# EAGLE design matrix-cell (EAGLE 7.2.0)
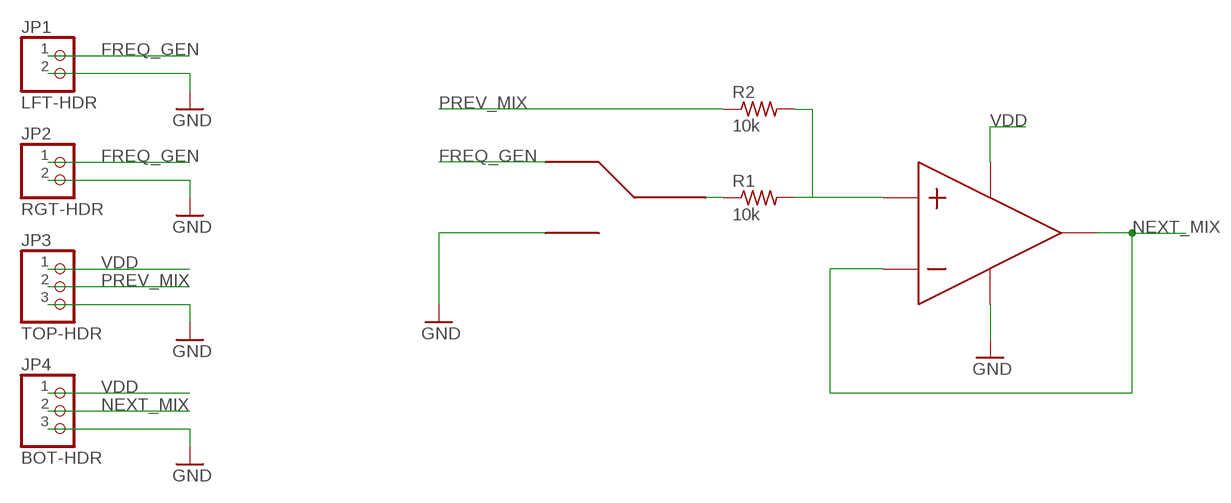
[diagram p0: schematic, sheet 1]

## Parts
JP1  LFT-HDR  PINHD-1X2/90  [1X02/90]
JP2  RGT-HDR  PINHD-1X2/90  [1X02/90]
JP3  TOP-HDR  PINHD-1X3/90  [1X03/90]
JP4  BOT-HDR  PINHD-1X3/90  [1X03/90]
R1  10k  R-US_R1206  [R1206]
R2  10k  R-US_R1206  [R1206]
U$1  RA1-SWITCH  [RA11131100-SWITCH]
U$2  MCP4162-OPAMP  [SO08]

## Nets
FREQ_GEN: JP1.1 JP2.1 U$1.R(NO)
GND: JP1.2 JP2.2 JP3.3 JP4.3 U$1.L(NC) U$2.4(VSS)
N$1: R1.2 R2.2 U$2.3(NON-INV)
N$2: R1.1 U$1.C(COMM)
NEXT_MIX: JP4.2 U$2.2(INV) U$2.6(OUT)
PREV_MIX: JP3.2 R2.1
VDD: JP3.1 JP4.1 U$2.7(VDD)

## Library data of the parts
JP1 JP2 = pinhead:PINHD-1X2: PIN HEADER
JP3 JP4 = pinhead:PINHD-1X3: PIN HEADER
R1 R2 = rcl:R-US_: RESISTOR, American symbol
U$1 = Tone-Matrix:RA1-SWITCH
U$2 = Tone-Matrix:MCP4162-OPAMP

## Board
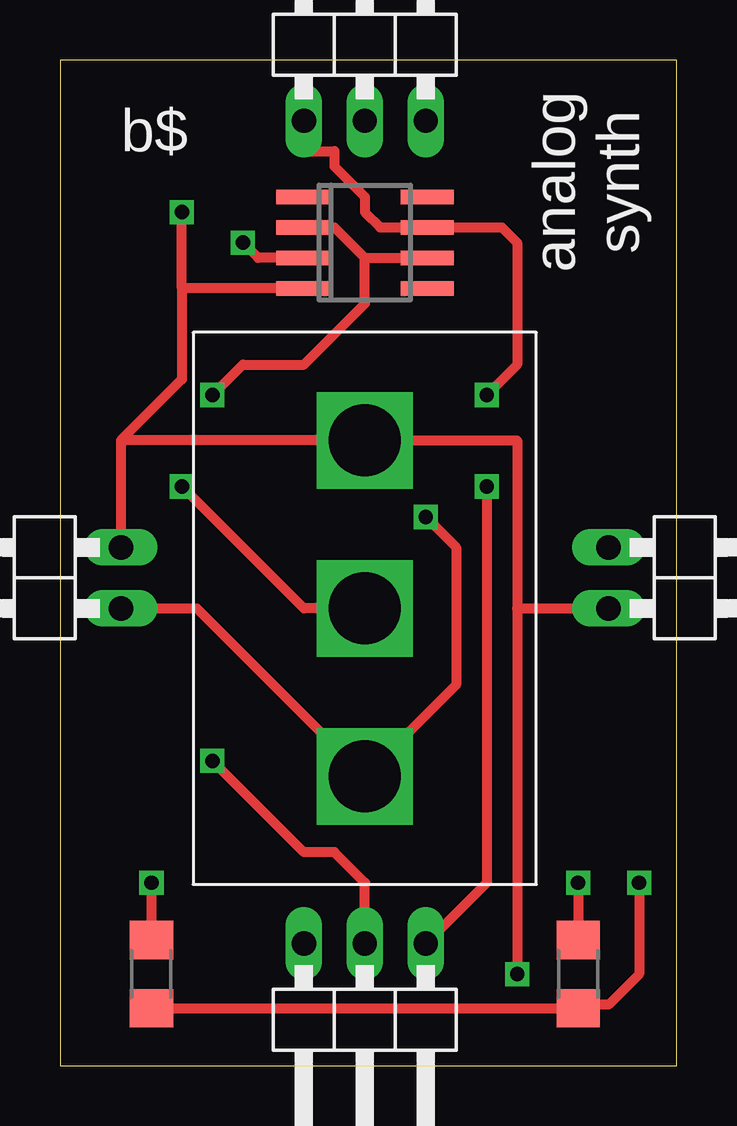
[diagram p1: board, top side]
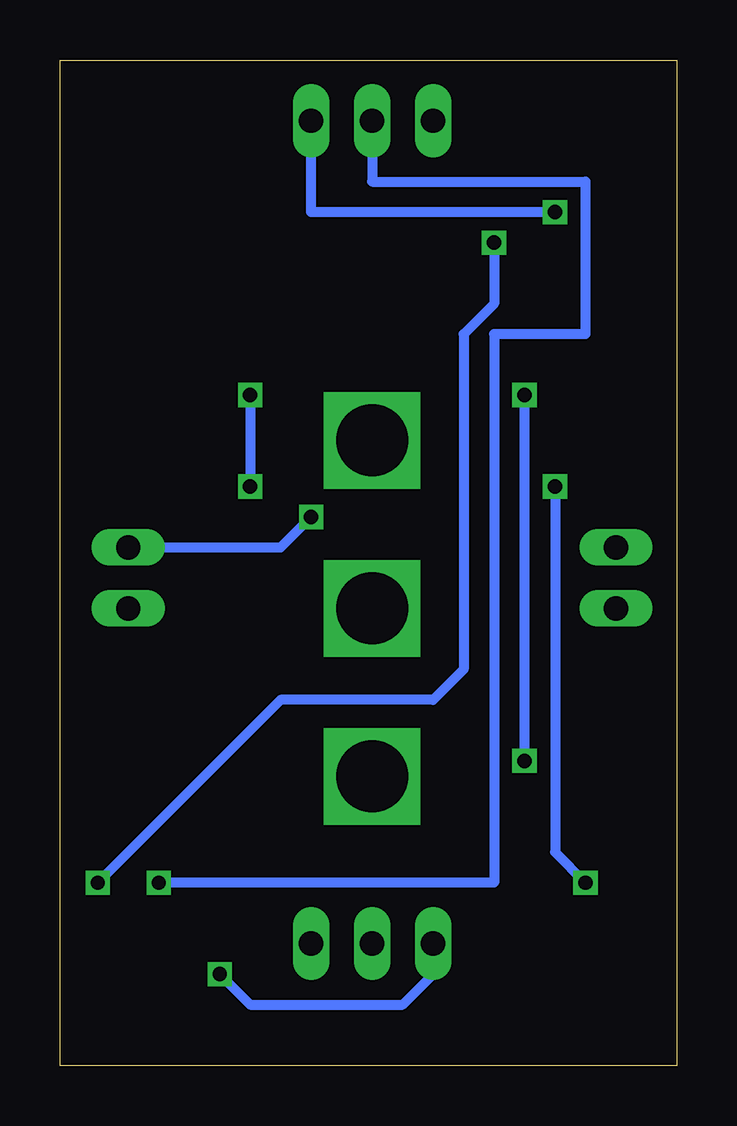
[diagram p2: board, bottom side, seen from below]

Size 25.7 x 41.9 mm. Coordinates in mm from the lower left corner, seen from the top.
Outline: 0,0 25.7,0 25.7,41.9 0,41.9 0,0
Copper layers (1*16): Top 0.035mm / dielectric 1.5mm / Bottom 0.035mm
Design rules "default": minimum track width 10mil, minimum drill 24mil, track to track 8mil, track to pad 8mil, pad to pad 8mil, via to via 8mil, smd to smd 8mil, copper to edge 40mil, drill to drill 8mil, minimum pad ring 10mil, minimum via ring 8mil, stop-mask expansion 4mil, vias tented up to drill 0mil, thermal gap 10mil

### Footprints (pad centres in the part's own frame; a part is rotated, then mirrored left to right if it is on the bottom)
1X02/90 = drill 1.016 long: 1 -1.27,-3.81; 2 1.27,-3.81
1X03/90 = drill 1.016 long: 1 -2.54,-3.81; 2 0,-3.81; 3 2.54,-3.81
R1206 = smd 1.6 x 1.803: 1 -1.422,0; 2 1.422,0
RA11131100-SWITCH = drill 3 square: C 0,0; L -7,0; R 7,0
SO08 = smd 0.6 x 2.2: 1 -1.905,-2.6; 2 -0.635,-2.6; 3 0.635,-2.6; 4 1.905,-2.6; 5 1.905,2.6; 6 0.635,2.6; 7 -0.635,2.6; 8 -1.905,2.6

### Placement (x,y rotation side)
JP1  -1.27,20.32 90 top
JP2  26.67,20.32 270 top
JP3  12.7,43.18 0 top
JP4  12.7,1.27 180 top
R1  3.81,3.81 270 top
R2  21.59,3.81 270 top
U$1  12.7,19.05 270 top
U$2  12.7,34.29 270 top

### Tracks (layer width: path | path; a pad name or v marks a point on that pad's centre or on a via)
FREQ_GEN  (via drill 0.6)
  Top 0.406: v15.24,22.86 16.51,21.59 16.51,15.86 U$1.R 5.7,19.05 JP1.1
  Bottom 0.406: JP2.1 16.51,21.59 v15.24,22.86
GND  (via drill 0.6)
  Top 0.406: 19.05,19.05 19.05,26.05 U$1.L 2.54,26.05 | 19.05,19.05 JP2.2 | 2.54,26.05 JP1.2 | U$2.4 5.08,32.38 | 5.08,32.38 v5.08,35.56 | 5.08,32.38 5.08,28.59 2.54,26.05 | 19.05,19.05 v19.05,3.81
  Bottom 0.406: v5.08,35.56 15.24,35.56 JP3.3 | v19.05,3.81 17.78,2.54 11.43,2.54 10.16,3.81 JP4.3
N$1  (via drill 0.6)
  Top 0.406: R1.2 R2.2 21.74,2.54 22.86,2.54 24.13,3.81 v24.13,7.62 | U$2.3 8.26,33.66 v7.62,34.29
  Bottom 0.406: v7.62,34.29 7.62,31.75 8.89,30.48 8.89,16.51 10.16,15.24 16.51,15.24 v24.13,7.62
N$2  (via drill 0.6)
  Top 0.406: U$1.C 10.16,19.05 v5.08,24.13 | v3.81,7.62 R1.1
  Bottom 0.406: v5.08,24.13 5.08,8.89 v3.81,7.62
NEXT_MIX  (via drill 0.6)
  Top 0.406: 12.7,33.66 U$2.6 | U$2.2 11.43,34.92 12.7,33.66 | JP4.2 12.7,7.62 11.43,8.89 10.16,8.89 v6.35,12.7 | v6.35,27.94 7.62,29.21 10.16,29.21 12.7,31.75 12.7,33.66
  Bottom 0.406: v6.35,12.7 v6.35,27.94
PREV_MIX  (via drill 0.6)
  Top 0.406: v21.59,7.62 R2.1
  Bottom 0.406: JP3.2 12.7,36.83 3.81,36.83 3.81,30.48 7.62,30.48 7.62,7.62 v21.59,7.62
VDD  (via drill 0.6)
  Top 0.406: v17.78,27.94 19.05,29.21 19.05,34.29 18.41,34.92 U$2.7 13.34,34.92 12.7,35.56 12.7,36.2 11.43,37.47 11.43,38.1 10.16,38.1 JP3.1 | v17.78,24.13 17.78,7.62 JP4.1
  Bottom 0.406: v17.78,27.94 v17.78,24.13

### Text on the board
tNames: b$ | analog / synth